# Altium schematic sheet TestSheet.SchDoc
size A4
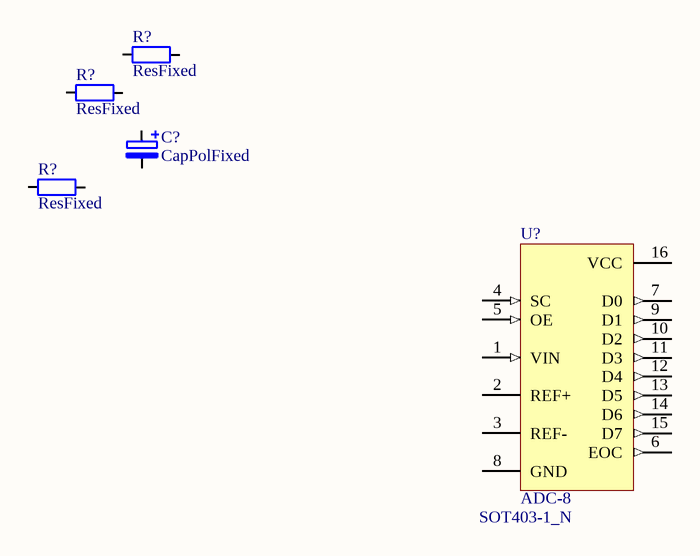
[diagram p0: TestSheet.SchDoc]

## Parts
(Parts that share a designator on the sheet are numbered #1, #2 ... from top to bottom, then left to right.)
C?  CapPolFixed
R?#1  ResFixed
R?#2  ResFixed
R?#3  ResFixed
U?  ADC-8  [SOT403-1_N]

## Nets

Not connected (* = marked no-connect by the designer): C? 1 2; R?#1 1 2; R?#2 1 2; R?#3 1 2; U? 1(VIN) 2(REF+) 3(REF-) 4(SC) 5(OE) 6(EOC) 7(D0) 8(GND) 9(D1) 10(D2) 11(D3) 12(D4) 13(D5) 14(D6) 15(D7) 16(VCC)

## Library data of the parts
R?#1-R?#3 = ResFixed: Resistor; Symbol: Rev.1 Petr Tosovsky 2014-02-20
U? = ADC-8: Generic 8-Bit A/D Converter; Published: 8-Jun-2000; LatestRevisionDate: 29-May-2009; LatestRevisionNote: IPC-7351 Footprint Added.; PackageVersion: Mar-2002; PackageReference: SOT403-1; Publisher: Altium Limited; PackageDescription: 16-Pin Thin Small Outline Package 0.65 mm Pitch; Code_JEDEC: MO-153; asdfasdf: SOT403-1_N